# Altium schematic sheet hand_shank.SchDoc
size A3; SheetNumber: 1; SheetTotal: 1
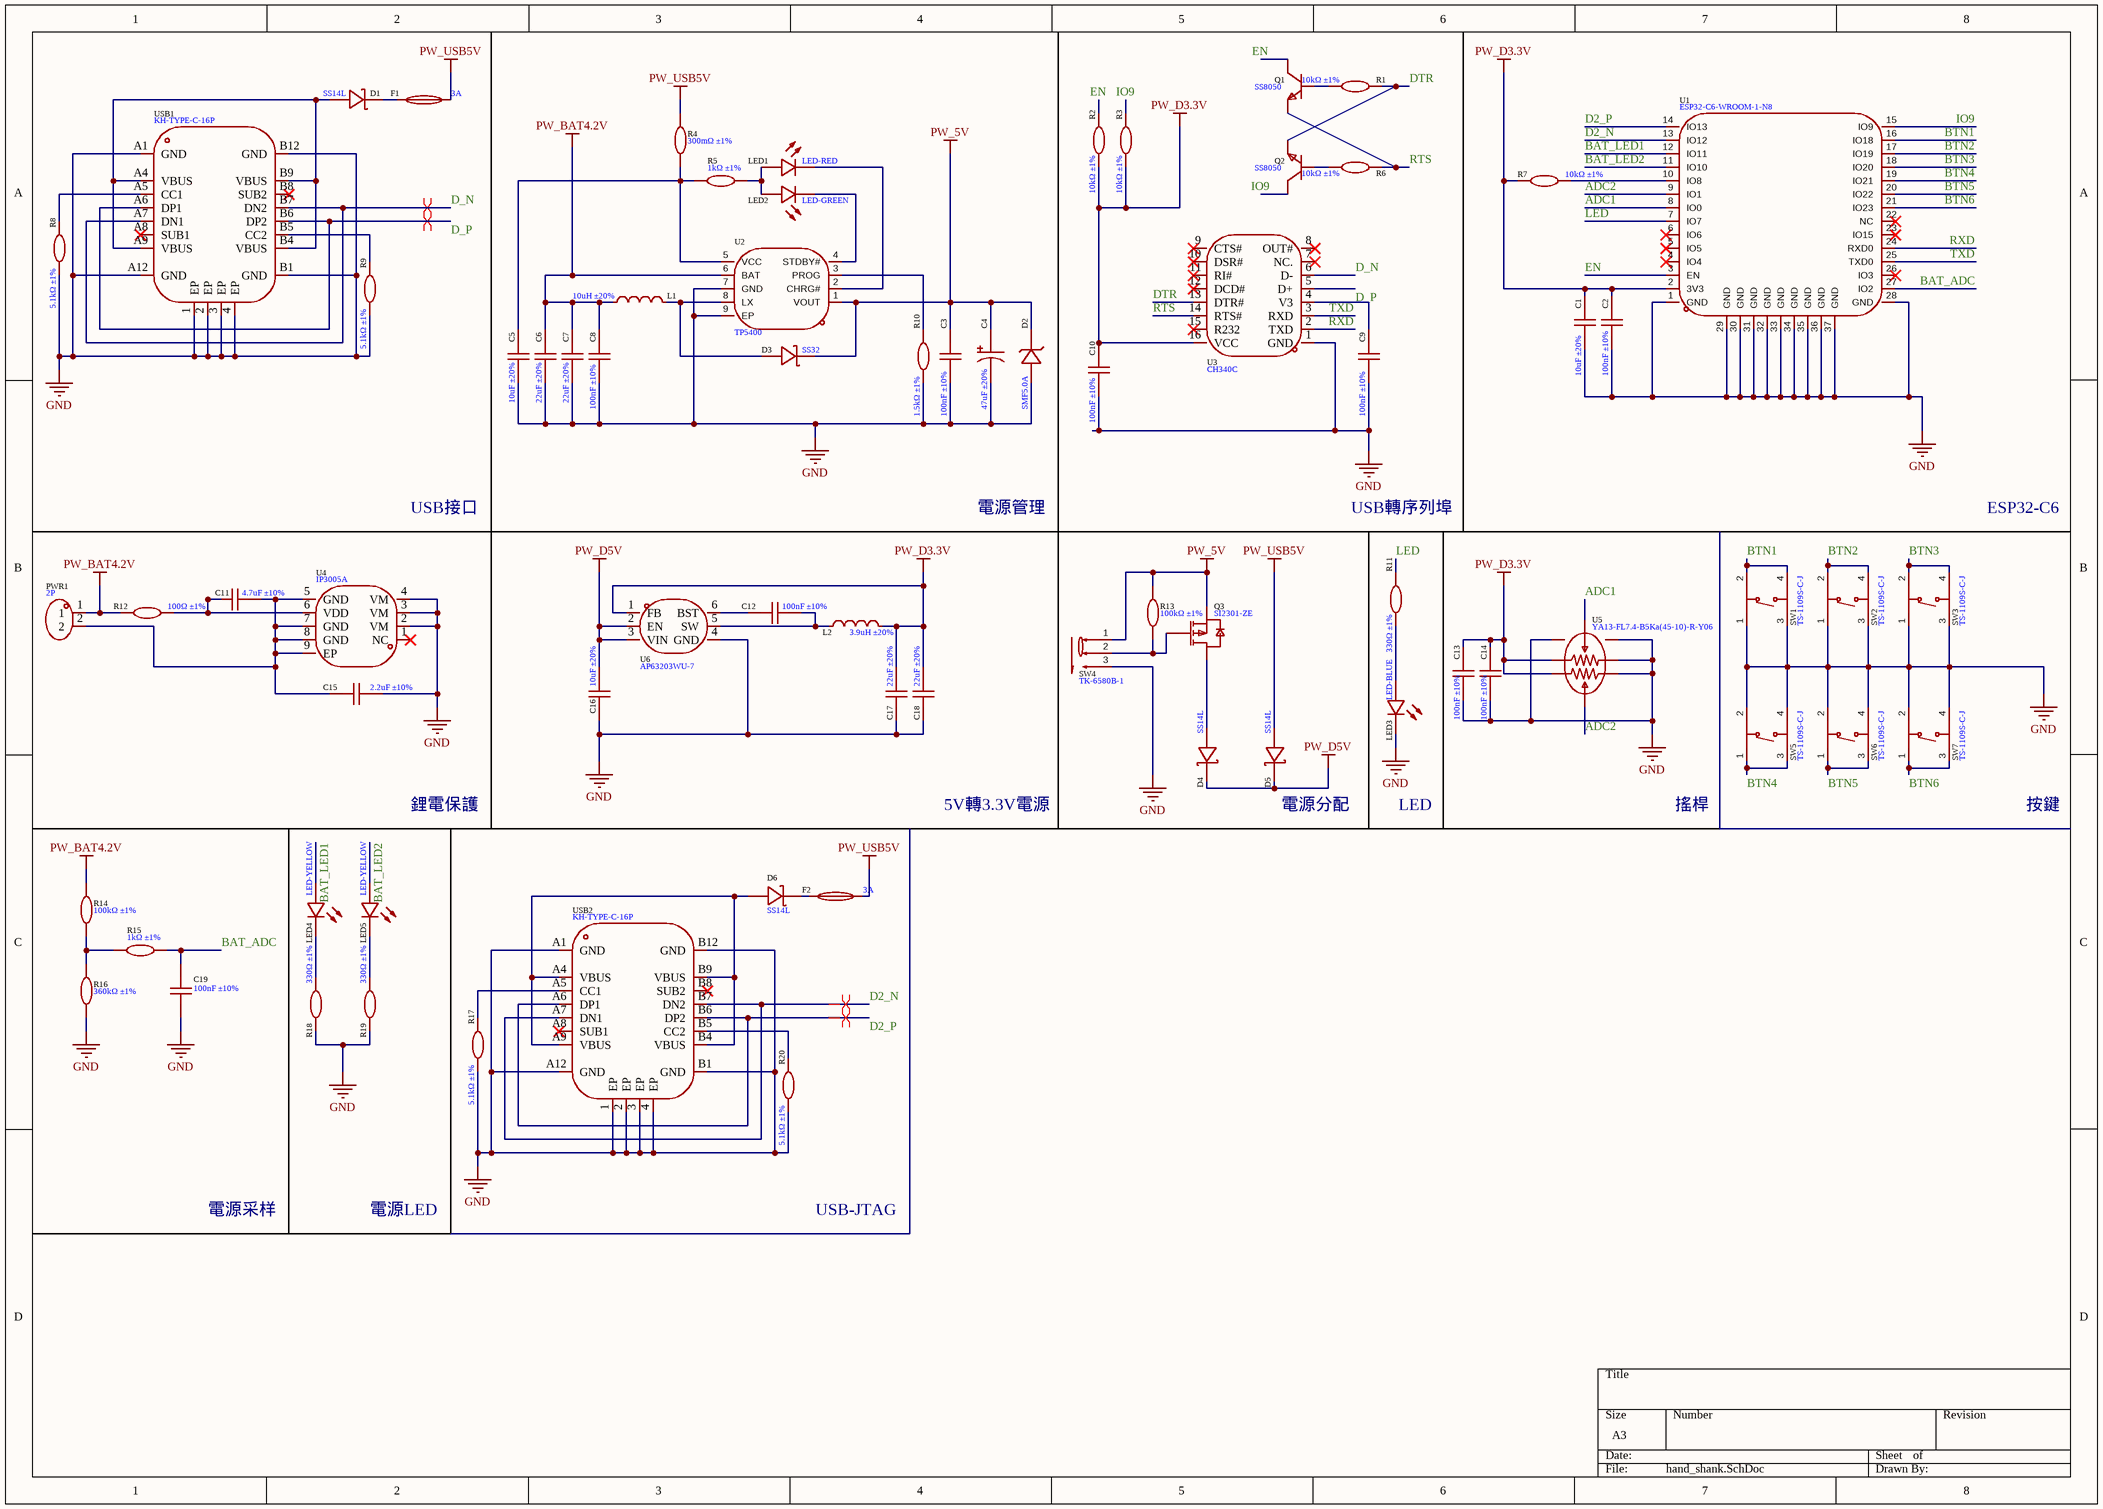
[diagram p0: hand_shank.SchDoc]

## Parts
C1  10uF ±20%  [C0603]
C2  100nF ±10%  [C0603]
C3  100nF ±10%  [C0603]
C4  47uF ±20%  [CAP-SMD_BD6.3-L6.5-W6.5-LS7.2-FD]
C5  10uF ±20%  [C0603]
C6  22uF ±20%  [C0805]
C7  22uF ±20%  [C0805]
C8  100nF ±10%  [C0603]
C9  100nF ±10%  [C0603]
C10  100nF ±10%  [C0603]
C11  4.7uF ±10%  [C0603]
C12  100nF ±10%  [C0603]
C13  100nF ±10%  [C0603]
C14  100nF ±10%  [C0603]
C15  2.2uF ±10%  [C0603]
C16  10uF ±20%  [C0603]
C17  22uF ±20%  [C0805]
C18  22uF ±20%  [C0805]
C19  100nF ±10%  [C0603]
D1  SS14L  [SOD-123F_L2.8-W1.8-LS3.7-RD]
D2  SMF5.0A  [SOD-123FL_L2.7-W1.8-LS3.8-RD]
D3  SS32  [SMA_L4.3-W2.6-LS5.0-RD]
D4  SS14L  [SOD-123F_L2.8-W1.8-LS3.7-RD]
D5  SS14L  [SOD-123F_L2.8-W1.8-LS3.7-RD]
D6  SS14L  [SOD-123F_L2.8-W1.8-LS3.7-RD]
F1  3A  [F1206]
F2  3A  [F1206]
L1  10uH ±20%  [IND-SMD_L7.3-W6.8]
L2  3.9uH ±20%  [IND-SMD_L4.0-W4.0_FNR40XXS]
LED1  LED-RED  [LED0603-RD]
LED2  LED-GREEN  [LED0603-RD]
LED3  LED-BLUE  [LED0603-RD]
LED4  LED-YELLOW  [LED0603-RD]
LED5  LED-YELLOW  [LED0603-RD]
PWR1  2P  [CONN-TH_HC-C5080-2AS]
Q1  SS8050  [SOT-23-3]
Q2  SS8050  [SOT-23-3]
Q3  SI2301-ZE  [SOT-23-3]
R1  10kΩ ±1%  [R0603]
R2  10kΩ ±1%  [R0603]
R3  10kΩ ±1%  [R0603]
R4  300mΩ ±1%  [R1206]
R5  1kΩ ±1%  [R0603]
R6  10kΩ ±1%  [R0603]
R7  10kΩ ±1%  [R0603]
R8  5.1kΩ ±1%  [R0603]
R9  5.1kΩ ±1%  [R0603]
R10  1.5kΩ ±1%  [R0603]
R11  330Ω ±1%  [R0603]
R12  100Ω ±1%  [R0603]
R13  100kΩ ±1%  [R0603]
R14  100kΩ ±1%  [R0603]
R15  1kΩ ±1%  [R0603]
R16  360kΩ ±1%  [R0603]
R17  5.1kΩ ±1%  [R0603]
R18  330Ω ±1%  [R0603]
R19  330Ω ±1%  [R0603]
R20  5.1kΩ ±1%  [R0603]
SW1  TS-1109S-C-J  [SW-SMD_4P-L4.5-W4.5-P3.00-LS7.0]
SW2  TS-1109S-C-J  [SW-SMD_4P-L4.5-W4.5-P3.00-LS7.0]
SW3  TS-1109S-C-J  [SW-SMD_4P-L4.5-W4.5-P3.00-LS7.0]
SW4  TK-6580B-1  [SW-TH_TK-6580B-1]
SW5  TS-1109S-C-J  [SW-SMD_4P-L4.5-W4.5-P3.00-LS7.0]
SW6  TS-1109S-C-J  [SW-SMD_4P-L4.5-W4.5-P3.00-LS7.0]
SW7  TS-1109S-C-J  [SW-SMD_4P-L4.5-W4.5-P3.00-LS7.0]
U1  ESP32-C6-WROOM-1-N8  [WIRELM-SMD_ESP32-C6-WROOM-1]
U2  TP5400  [ESOP-8_L4.9-W3.9-P1.27-LS6.0-BL-EP]
U3  CH340C  [SOP-16_L10.0-W3.9-P1.27-LS6.0-BL]
U4  IP3005A  [ESOP-8_L4.9-W3.9-P1.27-LS6.0-BL-EP]
U5  YA13-FL7.4-B5Ka(45-10)-R-Y06  [RES-ADJ-TH_YA13-FL7.4-B5KA-45-10-R-Y06_1]
U6  AP63203WU-7  [TSOT-26_L2.9-W1.6-P0.95-LS2.8-BL]
USB1  KH-TYPE-C-16P  [USB-C-SMD_KH-TYPE-C-16P]
USB2  KH-TYPE-C-16P  [USB-C-SMD_KH-TYPE-C-16P]

## Nets
GND: C1.1 C2.1 C3.1 C4.2 C5.1 C6.1 C7.1 C8.2 C9.1 C10.1 C13.1 C14.1 C15.2 C16.2 C17.1 C18.1 C19.1 D2.2(A) LED3.1(K) R8.1 R9.1 R10.1 R16.2 R17.1 R18.1 R19.1 R20.1 SW1.1 SW1.3 SW2.1 SW2.3 SW3.1 SW3.3 SW4.3 SW5.2 SW5.4 SW6.2 SW6.4 SW7.2 SW7.4 U1.1(GND) U1.28(GND) U1.29(GND) U1.30(GND) U1.31(GND) U1.32(GND) U1.33(GND) U1.34(GND) U1.35(GND) U1.36(GND) U1.37(GND) U2.7(GND) U2.9(EP) U3.1(GND) U4.2(VM) U4.3(VM) U4.4(VM) U5.1 U5.4 U5.7 U5.8 U6.4(GND) USB1.1(EP) USB1.2(EP) USB1.3(EP) USB1.4(EP) USB1.A1(GND) USB1.A12(GND) USB1.B1(GND) USB1.B12(GND) USB2.1(EP) USB2.2(EP) USB2.3(EP) USB2.4(EP) USB2.A1(GND) USB2.A12(GND) USB2.B1(GND) USB2.B12(GND)
PW_5V: C3.2 C4.1 D2.1(K) D3.1(K) Q3.2(S) R13.2 SW4.1 U2.1(VOUT)
PW_BAT4.2V: C6.2 C7.2 C8.1 L1.1 PWR1.1 R12.1 R14.2 U2.6(BAT)
PW_D3.3V: C1.2 C2.2 C10.2 C13.2 C14.2 C17.2 C18.2 L2.2 R2.1 R3.1 R7.1 U1.2(3V3) U3.16(VCC) U5.3 U5.6 U6.1(FB)
PW_D5V: C16.1 D4.1(K) D5.1(K) U6.2(EN) U6.3(VIN)
PW_USB5V: D5.2(A) F1.2 F2.2 R4.2
ADC1: U1.8(IO0) U5.2
ADC2: U1.9(IO1) U5.5
BAT_ADC: C19.2 R15.2 U1.27(IO2)
BAT_LED1: LED4.2(A) U1.12(IO11)
BAT_LED2: LED5.2(A) U1.11(IO10)
BTN1: SW1.2 SW1.4 U1.16(IO18)
BTN2: SW2.2 SW2.4 U1.17(IO19)
BTN3: SW3.2 SW3.4 U1.18(IO20)
BTN4: SW5.1 SW5.3 U1.19(IO21)
BTN5: SW6.1 SW6.3 U1.20(IO22)
BTN6: SW7.1 SW7.3 U1.21(IO23)
D2_N: U1.13(IO12) USB2.A7(DN1) USB2.B7(DN2)
D2_P: U1.14(IO13) USB2.A6(DP1) USB2.B6(DP2)
D_N: U3.6(D-) USB1.A7(DN1) USB1.B7(DN2)
D_P: U3.5(D+) USB1.A6(DP1) USB1.B6(DP2)
DTR: Q2.2(E) R1.2 U3.13(DTR#)
EN: Q1.3(C) R2.2 U1.3(EN)
IO9: Q2.3(C) R3.2 U1.15(IO9)
LED: R11.2 U1.7(IO7)
RTS: Q1.2(E) R6.2 U3.14(RTS#)
RXD: U1.24(RXD0) U3.2(TXD)
TXD: U1.25(TXD0) U3.3(RXD)
NetC5_2: C5.2 R4.1 R5.2 U2.5(VCC)
NetC9_2: C9.2 U3.4(V3)
NetC11_1: C11.1 R12.2 U4.6(VDD)
NetC11_2: C11.2 C15.1 PWR1.2 U4.5(GND) U4.7(GND) U4.8(GND) U4.9(EP)
NetC12_1: C12.1 U6.6(BST)
NetC12_2: C12.2 L2.1 U6.5(SW)
NetD1_1: D1.1(K) F1.1
NetD1_2: D1.2(A) USB1.A4(VBUS) USB1.A9(VBUS) USB1.B4(VBUS) USB1.B9(VBUS)
NetD3_2: D3.2(A) L1.2 U2.8(LX)
NetD4_2: D4.2(A) Q3.3(D)
NetD6_1: D6.1(K) F2.1
NetD6_2: D6.2(A) USB2.A4(VBUS) USB2.A9(VBUS) USB2.B4(VBUS) USB2.B9(VBUS)
NetLED1_1: LED1.1(K) U2.2(CHRG#)
NetLED1_2: LED1.2(A) LED2.2(A) R5.1
NetLED2_1: LED2.1(K) U2.4(STDBY#)
NetLED3_2: LED3.2(A) R11.1
NetLED4_1: LED4.1(K) R18.2
NetLED5_1: LED5.1(K) R19.2
NetQ1_1: Q1.1(B) R1.1
NetQ2_1: Q2.1(B) R6.1
NetQ3_1: Q3.1(G) R13.1 SW4.2
NetR7_2: R7.2 U1.10(IO8)
NetR8_2: R8.2 USB1.A5(CC1)
NetR9_2: R9.2 USB1.B5(CC2)
NetR10_2: R10.2 U2.3(PROG)
NetR14_1: R14.1 R15.1 R16.1
NetR17_2: R17.2 USB2.A5(CC1)
NetR20_2: R20.2 USB2.B5(CC2)

Not connected (* = marked no-connect by the designer): U1 4(IO4)* 5(IO5)* 6(IO6)* 22(NC)* 23(IO15)* 26(IO3)*; U3 7(NC.)* 8(OUT#)* 9(CTS#)* 10(DSR#)* 11(RI#)* 12(DCD#)* 15(R232)*; U4 1(NC)*; USB1 A8(SUB1)* B8(SUB2)*; USB2 A8(SUB1)* B8(SUB2)*

## Layout directives
differential pair: D2_N, D2_P, D_N, D_P

## Notes on the sheet
- USB接口
- 電源管理
- USB轉序列埠
- ESP32-C6
- 鋰電保護
- 5V轉3.3V電源
- (near D5) 電源分配
- LED
- 搖桿
- 按鍵
- 電源采样
- 電源LED
- USB-JTAG

## Library data of the parts
C1 C5 C16 = CL10A106MA8NRNC: Manufacturer: SAMSUNG; Manufacturer_Part: CL10A106MA8NRNC; Value: 10uF ±20%
C2 C3 C8-C10 C12-C14 C19 = CL10B104KB8NNNC: Manufacturer: SAMSUNG; Manufacturer_Part: CL10B104KB8NNNC; Value: 100nF ±10%
C4 = RVE25V47M6X5: Manufacturer: JIERR; Manufacturer_Part: RVE25V47M6X5; Value: 47uF ±20%
C6 C7 C17 C18 = CL21A226MAQNNNE: Manufacturer: SAMSUNG; Manufacturer_Part: CL21A226MAQNNNE; Value: 22uF ±20%
C11 = CL10A475KO8NNNC: Manufacturer: SAMSUNG; Manufacturer_Part: CL10A475KO8NNNC; Value: 4.7uF ±10%
C15 = CL10A225KB8NNNC: Manufacturer: SAMSUNG; Manufacturer_Part: CL10A225KB8NNNC; Value: 2.2uF ±10%
D1 D4-D6 = SS14L: Manufacturer: Hottech; Manufacturer_Part: SS14L; Value: SS14L
D2 = SMF5.0A: Manufacturer: R+O; Manufacturer_Part: SMF5.0A; Value: SMF5.0A
D3 = SS32: Manufacturer: R+O; Manufacturer_Part: SS32; Value: SS32
F1 F2 = 12H1300C: Manufacturer: LANSON; Manufacturer_Part: 12H1300C; Value: 3A
L1 = FXL0630-100-M: Manufacturer: cjiang; Manufacturer_Part: FXL0630-100-M; Value: 10uH ±20%
L2 = FNR4030S3R9MT: Manufacturer: cjiang; Manufacturer_Part: FNR4030S3R9MT; Value: 3.9uH ±20%
LED1 = NCD0603R1: Manufacturer: nationstar; Manufacturer_Part: NCD0603R1; Value: LED-RED
LED2 = NCD0603G1: Manufacturer: nationstar; Manufacturer_Part: NCD0603G1; Value: LED-GREEN
LED3 = NCD0603B1: Manufacturer: nationstar; Manufacturer_Part: NCD0603B1; Value: LED-BLUE
LED4 LED5 = NCD0603Y1: Manufacturer: nationstar; Manufacturer_Part: NCD0603Y1; Value: LED-YELLOW
PWR1 = HC-C5080-2AS: Manufacturer: HCTL; Manufacturer_Part: HC-C5080-2AS; Value: 2P
Q1 Q2 = SS8050: Manufacturer: AnBon; Add into BOM: yes; Transistor Type: NPN; Collector Current (Ic): 1.5A; Collector-Emitter Breakdown Voltage (Vceo): 25V; Power Dissipation (Pd): 225mW; DC Current Gain (hFE@Ic,Vce): 200@100mA,1V; Collector Cut-Off Current (Icbo): 150nA; Collector-Emitter Saturation Voltage (VCE(sat)@Ic,Ib): 500mV@800mA,80mA; Manufacturer Part: SS8050; Supplier Footprint: SOT-23; JLCPCB Part Class: Extended Part; Datasheet: https://atta.szlcsc.com/upload/public/pdf/source/20200522/C541705_DD3461D9C64B1D59801CB3041082AFC6.pdf; Supplier: LCSC; Convert to PCB: yes; Transition Frequency (fT): -; Operating Temperature: -55℃~+150℃@(Tj); Manufacturer_Part: SS8050; Value: SS8050
Q3 = SI2301-ZE: Manufacturer: HXY; Symbol: SI2301-ZE; Manufacturer_Part: SI2301-ZE; Value: SI2301-ZE
R1-R3 R6 R7 = 0603WAF1002T5E: Manufacturer: UNI-ROYAL; Manufacturer_Part: 0603WAF1002T5E; Value: 10kΩ ±1%
R4 = HoYH1206-1W-300mR-1%: Manufacturer: Milliohm; Manufacturer_Part: HoYH1206-1W-300mR-1%; Value: 300mΩ ±1%
R5 R15 = 0603WAF1001T5E: Manufacturer: UNI-ROYAL; Manufacturer_Part: 0603WAF1001T5E; Value: 1kΩ ±1%
R8 R9 R17 R20 = 0603WAF5101T5E: Manufacturer: UNI-ROYAL; Manufacturer_Part: 0603WAF5101T5E; Value: 5.1kΩ ±1%
R10 = 0603WAF1501T5E: Manufacturer: UNI-ROYAL; Manufacturer_Part: 0603WAF1501T5E; Value: 1.5kΩ ±1%
R11 R18 R19 = 0603WAF3300T5E: Manufacturer: UNI-ROYAL; Manufacturer_Part: 0603WAF3300T5E; Value: 330Ω ±1%
R12 = 0603WAF1000T5E: Manufacturer: UNI-ROYAL; Manufacturer_Part: 0603WAF1000T5E; Value: 100Ω ±1%
R13 R14 = 0603WAF1003T5E: Manufacturer: UNI-ROYAL; Manufacturer_Part: 0603WAF1003T5E; Value: 100kΩ ±1%
R16 = 0603WAF3603T5E: Manufacturer: UNI-ROYAL; Manufacturer_Part: 0603WAF3603T5E; Value: 360kΩ ±1%
SW1-SW3 SW5-SW7 = TS-1109S-C-J: Manufacturer: XKB Connection; Symbol: TS-1109S-C-J; Manufacturer_Part: TS-1109S-C-J; Value: TS-1109S-C-J
SW4 = TK-6580B-1: Manufacturer: Yuandi; Symbol: TK-6580B-1; Manufacturer_Part: TK-6580B-1; Value: TK-6580B-1
U1 = ESP32-C6-WROOM-1-N8: Manufacturer: ESPRESSIF; Manufacturer_Part: ESP32-C6-WROOM-1-N8; Value: ESP32-C6-WROOM-1-N8; Type: MCU
U2 = TP5400: Manufacturer: TOPPOWER; Manufacturer_Part: TP5400; Value: TP5400; Type: power
U3 = CH340C: Manufacturer: WCH; Manufacturer_Part: CH340C; Value: CH340C; Type: Interface
U4 = IP3005A: Manufacturer: INJOINIC; Manufacturer_Part: IP3005A; Value: IP3005A; Type: power
U5 = YA13-FL7.4-B5Ka(45-10)-R-Y06: Manufacturer: YTL; Manufacturer_Part: YA13-FL7.4-B5Ka(45-10)-R-Y06; Value: YA13-FL7.4-B5Ka(45-10)-R-Y06; Type: joystick
U6 = AP63203WU-7: Manufacturer: DIODES; Manufacturer_Part: AP63203WU-7; Value: AP63203WU-7; Type: power
USB1 USB2 = KH-TYPE-C-16P: Manufacturer: kinghelm; Manufacturer_Part: KH-TYPE-C-16P; Value: KH-TYPE-C-16P